# Altium schematic sheet USB_Serial.schdoc
size 232 x 199 mm
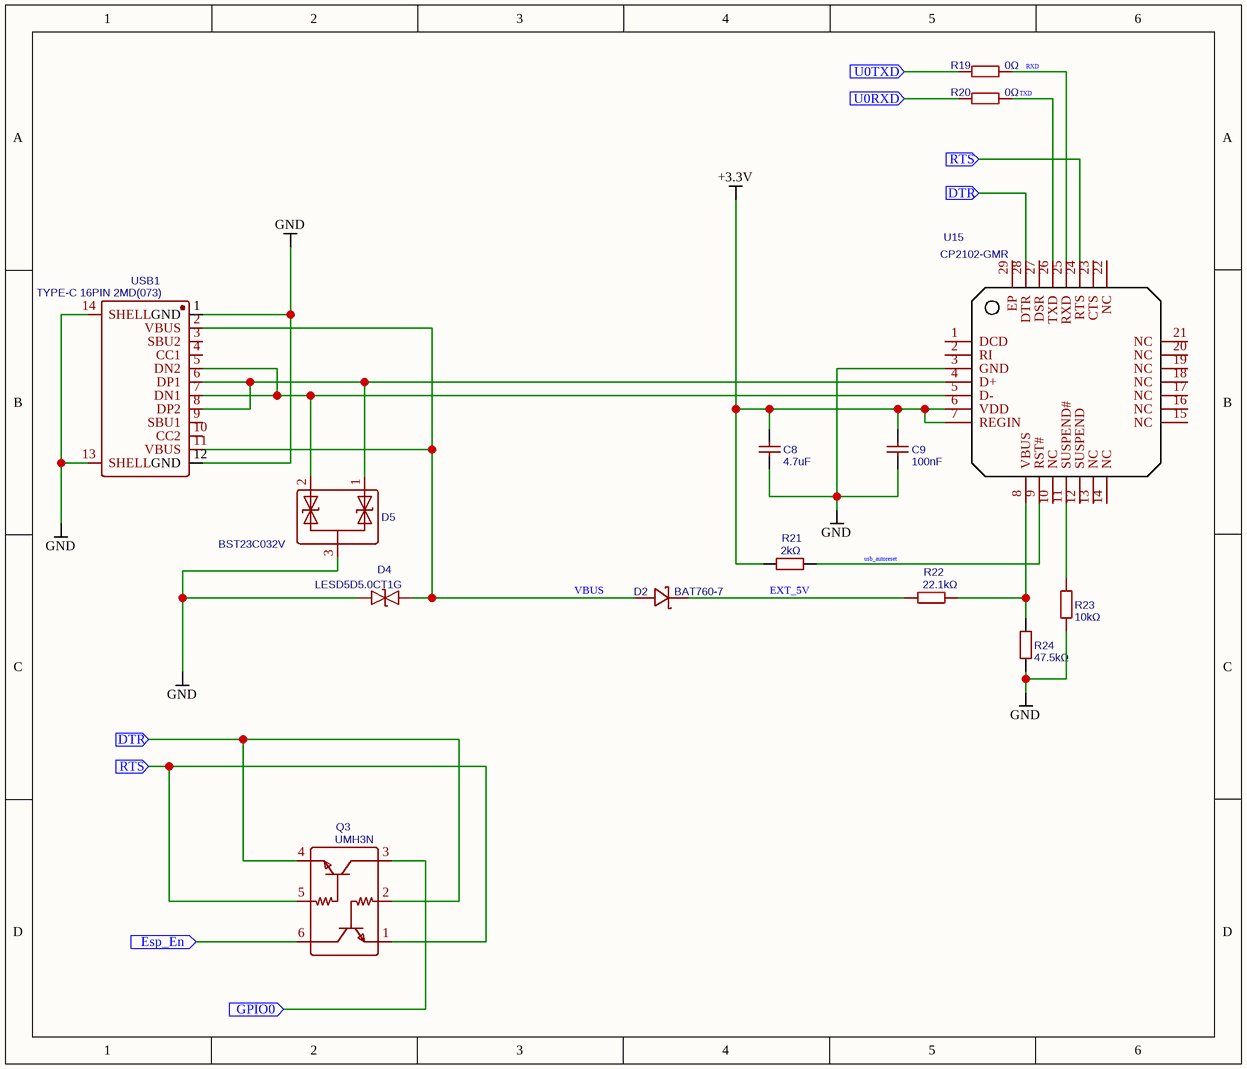
[diagram p0: USB_Serial.schdoc]

## Parts
C8  4.7uF  [C0603]
C9  100nF  [C0603]
D2  BAT760-7  [SOD-323_L1.8-W1.3-LS2.5-RD]
D4  LESD5D5.0CT1G  [SOD-523_L1.2-W0.8-LS1.6-BI]
D5  BST23C032V  [SOT-23_L2.9-W1.3-P1.90-LS2.4-BR]
Q3  UMH3N  [SC-70-6_L2.2-W1.3-P0.65-LS2.1-BR]
R19  0Ω  [R0603]
R20  0Ω  [R0603]
R21  2kΩ  [R0603]
R22  22.1kΩ  [R0603]
R23  10kΩ  [R0603]
R24  47.5kΩ  [R0603]
U15  CP2102-GMR  [QFN-28_L5.0-W5.0-P0.50-BL-EP]
USB1  TYPE-C 16PIN 2MD(073)  [USB-C-SMD_TYPE-C-6PIN-2MD-073]

## Ports
DTR (in), Esp_En (in), GPIO0 (in), RTS (in), U0RXD (in), U0TXD (in)

## Nets
+3.3V: C8.2 C9.2 R21.1 U15.6(VDD) U15.7(REGIN)
GND: C8.1 C9.1 D4.1 D5.3 R23.1 R24.1 U15.3(GND) USB1.1(GND) USB1.12(GND) USB1.13(SHELL) USB1.14(SHELL)
DTR: Q3.2(B) Q3.4(E) U15.28(DTR) ; port DTR
Esp_En: Q3.6(C) ; port Esp_En
EXT_5V: D2.1 R22.1
GPIO0: Q3.3(C) ; port GPIO0
RTS: Q3.1(E) Q3.5(B) U15.24(RTS) ; port RTS
RXD: R19.2 U15.25(RXD)
TXD: R20.2 U15.26(TXD)
U0RXD: R20.1 ; port U0RXD
U0TXD: R19.1 ; port U0TXD
usb_autoreset: R21.2 U15.9(RST#)
VBUS: D2.2 D4.2 USB1.2(VBUS) USB1.11(VBUS)
NetD5_1: D5.1 U15.4(D+) USB1.6(DP1) USB1.8(DP2)
NetD5_2: D5.2 U15.5(D-) USB1.5(DN2) USB1.7(DN1)
NetR22_2: R22.2 R24.2 U15.8(VBUS)
NetR23_2: R23.2 U15.11(SUSPEND#)

Not connected (* = marked no-connect by the designer): U15 1(DCD) 2(RI) 10(NC) 12(SUSPEND) 13(NC) 14(NC) 15(NC) 16(NC) 17(NC) 18(NC) 19(NC) 20(NC) 21(NC) 22(NC) 23(CTS) 27(DSR) 29(EP); USB1 3(SBU2) 4(CC1) 9(SBU1) 10(CC2)

## Library data of the parts
C8 = 4.7uF: Manufacturer: FH; Manufacturer Part: 0603X475K160NT; nameAlias: Capacitance; Supplier: LCSC; Supplier Part: C99229; JLCPCB Part Class: Extended Part; spicePre: C; spiceSymbolName: 0603X475K160NT
C9 = 100nF: Manufacturer: SAMSUNG; Manufacturer Part: CL10B104KO8NNNC; nameAlias: Capacitance; Supplier: LCSC; Supplier Part: C66501; JLCPCB Part Class: Extended Part; spicePre: C; spiceSymbolName: CL10B104KO8NNNC
D2 = BAT760-7: Manufacturer: DIODES; Contributor: LCSC; Supplier: LCSC; Manufacturer Part: BAT760-7; Supplier Part: C124187; JLCPCB Part Class: Extended Part; spicePre: D; spiceSymbolName: BAT760-7
D4 = LESD5D5.0CT1G: Manufacturer: Leshan Radio; Contributor: LCSC; Supplier: LCSC; Supplier Part: C383211; Manufacturer Part: LESD5D5.0CT1G; JLCPCB Part Class: Extended Part; spicePre: D; spiceSymbolName: LESD5D5.0CT1G
D5 = BST23C032V: Manufacturer: Bourne Semicon (Shenzhen); Contributor: LCSC; Supplier: LCSC; Supplier Part: C151968; Manufacturer Part: BST23C032V; JLCPCB Part Class: Extended Part; spicePre: D; spiceSymbolName: BST23C032V
Q3 = UMH3N: Manufacturer: CJ; Supplier: LCSC; Manufacturer Part: UMH3N; Supplier Part: C62892; JLCPCB Part Class: Extended Part; spicePre: Q; spiceSymbolName: UMH3N
R19 R20 = 0Ω: Manufacturer: FH; Manufacturer Part: RS-03000FT; Resistance (Ohms): 0; nameAlias: Resistance; Contributor: LCSC; Supplier: LCSC; Supplier Part: C136582; JLCPCB Part Class: Extended Part; spicePre: R; spiceSymbolName: RS-03000FT
R21 = 2kΩ: Manufacturer: FH; Manufacturer Part: RS-03K2001FT; nameAlias: Resistance; Resistance (Ohms): 2K; Supplier: LCSC; Supplier Part: C115336; JLCPCB Part Class: Extended Part; spicePre: R; spiceSymbolName: RS-03K2001FT
R22 = 22.1kΩ: Manufacturer: Guangdong Fenghua Advanced Tech; Manufacturer Part: RS-03K2212FT; Resistance (Ohms): 22.1K; nameAlias: Resistance; Contributor: LCSC; Supplier: LCSC; Supplier Part: C310274; JLCPCB Part Class: Extended Part; spicePre: R; spiceSymbolName: RS-03K2212FT
R23 = 10kΩ: Manufacturer: Guangdong Fenghua Advanced Tech; Manufacturer Part: RS-03K1002FT; Resistance (Ohms): 10K; nameAlias: Resistance; Contributor: LCSC; Supplier: LCSC; Supplier Part: C115324; JLCPCB Part Class: Extended Part; spicePre: R; spiceSymbolName: RS-03K1002FT
R24 = 47.5kΩ: Manufacturer: UniOhm; Manufacturer Part: 0603WAF4752T5E; nameAlias: Resistance; Resistance (Ohms): 47.5K; Supplier: LCSC; Supplier Part: C23061; JLCPCB Part Class: Extended Part; spicePre: R; spiceSymbolName: 0603WAF4752T5E
U15 = CP2102-GMR: Manufacturer: SILICON LABS; Supplier: LCSC; Manufacturer Part: CP2102-GMR; Supplier Part: C6568; JLCPCB Part Class: Basic Part; spicePre: U; spiceSymbolName: CP2102-GMR
USB1 = TYPE-C 16PIN 2MD(073): Manufacturer: SHOU HAN(首韩); Contributor: LCSC; Supplier: LCSC; Supplier Part: C2765186; Manufacturer Part: TYPE-C 16PIN 2MD(073); JLCPCB Part Class: Extended Part; link: https://lcsc.com/eda_search?q=C2765186&%26type=1&ref=editor; spicePre: U; spiceSymbolName: TYPE-C 16PIN 2MD(073)